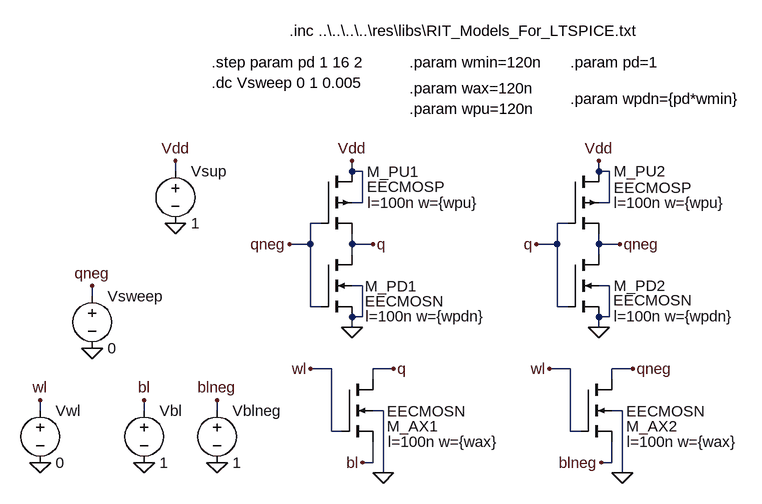
[diagram p0: schematic sram_sizing_sweep_hold.asc]
sram_sizing_sweep_hold.asc, the LTspice schematic file:
Version 4
SHEET 1 2116 1060
WIRE -160 0 -160 -16
WIRE 112 0 112 -16
WIRE 128 0 112 0
WIRE 492 0 492 -16
WIRE 508 0 492 0
WIRE 128 48 128 0
WIRE 128 48 112 48
WIRE 508 48 508 0
WIRE 508 48 492 48
WIRE 64 80 48 80
WIRE 444 80 428 80
WIRE 48 112 48 80
WIRE 48 112 16 112
WIRE 112 112 112 96
WIRE 144 112 112 112
WIRE 428 112 428 80
WIRE 428 112 396 112
WIRE 492 112 492 96
WIRE 524 112 492 112
WIRE 112 128 112 112
WIRE 492 128 492 112
WIRE 128 176 112 176
WIRE 508 176 492 176
WIRE -288 192 -288 176
WIRE 48 208 48 112
WIRE 64 208 48 208
WIRE 428 208 428 112
WIRE 444 208 428 208
WIRE 128 224 128 176
WIRE 128 224 112 224
WIRE 508 224 508 176
WIRE 508 224 492 224
WIRE 112 240 112 224
WIRE 492 240 492 224
WIRE 80 304 48 304
WIRE 176 304 144 304
WIRE 448 304 416 304
WIRE 544 304 512 304
WIRE 144 320 144 304
WIRE 512 320 512 304
WIRE -368 368 -368 352
WIRE -208 368 -208 352
WIRE -96 368 -96 352
WIRE 160 368 144 368
WIRE 528 368 512 368
WIRE 80 400 80 304
WIRE 96 400 80 400
WIRE 448 400 448 304
WIRE 464 400 448 400
WIRE 144 448 144 416
WIRE 144 448 128 448
WIRE 512 448 512 416
WIRE 512 448 496 448
WIRE 160 464 160 368
WIRE 528 464 528 368
FLAG 112 240 0
FLAG 112 -16 Vdd
FLAG 16 112 qneg
FLAG 144 112 q
FLAG 492 240 0
FLAG 492 -16 Vdd
FLAG 396 112 q
FLAG 524 112 qneg
FLAG 128 448 bl
FLAG 48 304 wl
FLAG 176 304 q
FLAG -160 -16 Vdd
FLAG -160 80 0
FLAG -288 176 qneg
FLAG -288 272 0
FLAG -368 352 wl
FLAG -368 448 0
FLAG -208 352 bl
FLAG -208 448 0
FLAG -96 352 blneg
FLAG -96 448 0
FLAG 160 464 0
FLAG 496 448 blneg
FLAG 416 304 wl
FLAG 544 304 qneg
FLAG 528 464 0
SYMBOL pmos4 64 0 R0
WINDOW 0 71 1 Left 2
WINDOW 3 71 24 Left 2
WINDOW 123 72 48 Left 2
SYMATTR InstName M_PU1
SYMATTR Value EECMOSP
SYMATTR Value2 l=100n w={wpu}
SYMBOL nmos4 64 128 R0
WINDOW 0 68 49 Left 2
WINDOW 3 68 72 Left 2
WINDOW 123 69 95 Left 2
SYMATTR InstName M_PD1
SYMATTR Value EECMOSN
SYMATTR Value2 l=100n w={wpdn}
SYMBOL pmos4 444 0 R0
WINDOW 0 71 0 Left 2
WINDOW 3 71 25 Left 2
WINDOW 123 71 48 Left 2
SYMATTR InstName M_PU2
SYMATTR Value EECMOSP
SYMATTR Value2 l=100n w={wpu}
SYMBOL nmos4 444 128 R0
WINDOW 0 71 48 Left 2
WINDOW 3 70 70 Left 2
WINDOW 123 71 95 Left 2
SYMATTR InstName M_PD2
SYMATTR Value EECMOSN
SYMATTR Value2 l=100n w={wpdn}
SYMBOL nmos4 96 320 R0
WINDOW 0 70 72 Left 2
WINDOW 3 70 49 Left 2
WINDOW 123 71 96 Left 2
SYMATTR InstName M_AX1
SYMATTR Value EECMOSN
SYMATTR Value2 l=100n w={wax}
SYMBOL voltage -160 -16 R0
WINDOW 123 0 0 Left 0
WINDOW 39 0 0 Left 0
SYMATTR InstName Vsup
SYMATTR Value 1
SYMBOL voltage -288 176 R0
WINDOW 123 0 0 Left 0
WINDOW 39 0 0 Left 0
SYMATTR InstName Vsweep
SYMATTR Value 0
SYMBOL voltage -368 352 R0
WINDOW 123 0 0 Left 0
WINDOW 39 0 0 Left 0
SYMATTR InstName Vwl
SYMATTR Value 0
SYMBOL voltage -208 352 R0
WINDOW 123 0 0 Left 0
WINDOW 39 0 0 Left 0
SYMATTR InstName Vbl
SYMATTR Value 1
SYMBOL voltage -96 352 R0
WINDOW 123 0 0 Left 0
WINDOW 39 0 0 Left 0
SYMATTR InstName Vblneg
SYMATTR Value 1
SYMBOL nmos4 464 320 R0
WINDOW 0 70 72 Left 2
WINDOW 3 70 49 Left 2
WINDOW 123 71 96 Left 2
SYMATTR InstName M_AX2
SYMATTR Value EECMOSN
SYMATTR Value2 l=100n w={wax}
TEXT 16 -216 Left 2 !.inc ..\\..\\..\\..\\res\\libs\\RIT_Models_For_LTSPICE.txt
TEXT 200 -168 Left 2 !.param wmin=120n
TEXT 200 -128 Left 2 !.param wax=120n
TEXT 200 -96 Left 2 !.param wpu=120n
TEXT 448 -168 Left 2 !.param pd=1
TEXT 448 -112 Left 2 !.param wpdn={pd*wmin}
TEXT -104 -168 Left 2 !.step param pd 1 16 2
TEXT -104 -136 Left 2 !.dc Vsweep 0 1 0.005

The netlist it stands for:
* sram_sizing_sweep_hold.asc
M_PU1 Vdd qneg q Vdd EECMOSP l=100n w={wpu}
M_PD1 q qneg 0 0 EECMOSN l=100n w={wpdn}
M_PU2 Vdd q qneg Vdd EECMOSP l=100n w={wpu}
M_PD2 qneg q 0 0 EECMOSN l=100n w={wpdn}
M_AX1 q wl bl 0 EECMOSN l=100n w={wax}
Vsup Vdd 0 1
Vsweep qneg 0 0
Vwl wl 0 0
Vbl bl 0 1
Vblneg blneg 0 1
M_AX2 qneg wl blneg 0 EECMOSN l=100n w={wax}
.model NMOS NMOS
.model PMOS PMOS
.lib standard.mos
.inc ..\..\..\..\res\libs\RIT_Models_For_LTSPICE.txt
.param wmin=120n
.param wax=120n
.param wpu=120n
.param pd=1
.param wpdn={pd*wmin}
.step param pd 1 16 2
.dc Vsweep 0 1 0.005
.backanno
.end